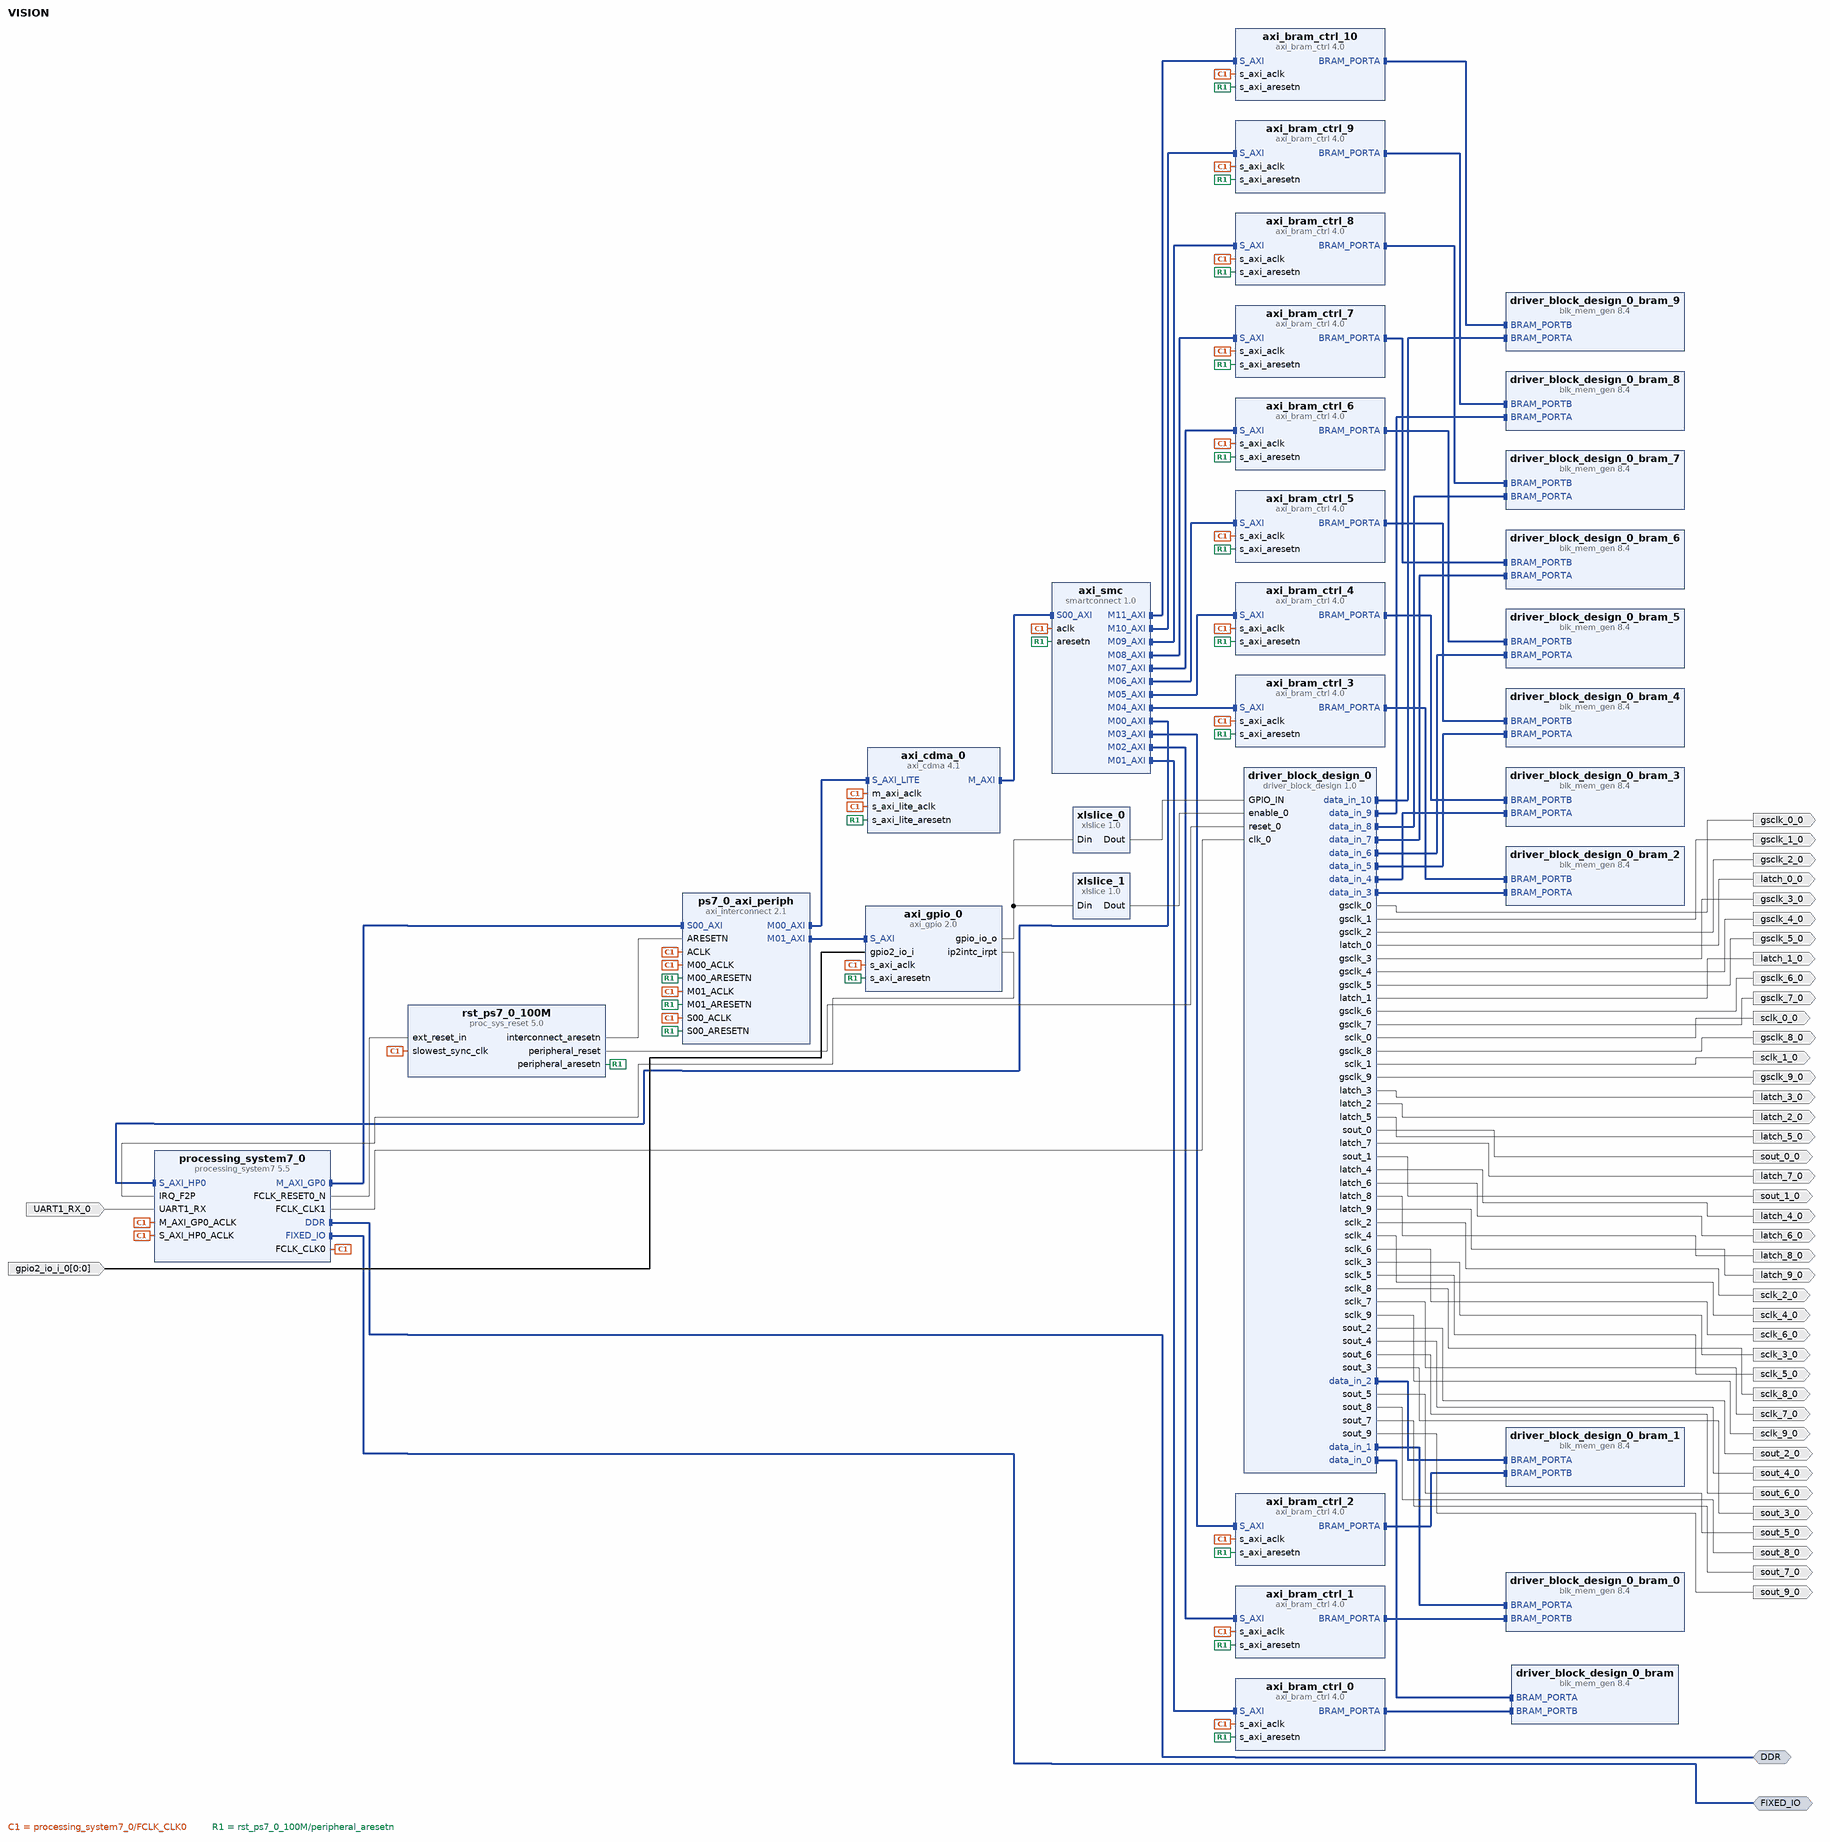
[diagram p0: block diagram of the top level]
# Vivado block design VISION, xc7z020clg400-1, Vivado 2018.2
create_bd_design VISION

create_bd_intf_port -mode Master -vlnv xilinx.com:interface:ddrx_rtl:1.0 DDR
create_bd_intf_port -mode Master -vlnv xilinx.com:display_processing_system7:fixedio_rtl:1.0 FIXED_IO
create_bd_port -dir O sclk_0_0
create_bd_port -dir O latch_0_0
create_bd_port -dir O gsclk_0_0
create_bd_port -dir O sout_0_0
create_bd_port -dir I -from 0 -to 0 gpio2_io_i_0
create_bd_port -dir I UART1_RX_0
create_bd_port -dir O sout_1_0
create_bd_port -dir O sclk_1_0
create_bd_port -dir O latch_1_0
create_bd_port -dir O gsclk_1_0
create_bd_port -dir O gsclk_3_0
create_bd_port -dir O gsclk_2_0
create_bd_port -dir O gsclk_4_0
create_bd_port -dir O gsclk_5_0
create_bd_port -dir O gsclk_6_0
create_bd_port -dir O gsclk_7_0
create_bd_port -dir O gsclk_8_0
create_bd_port -dir O gsclk_9_0
create_bd_port -dir O latch_7_0
create_bd_port -dir O latch_8_0
create_bd_port -dir O latch_5_0
create_bd_port -dir O latch_6_0
create_bd_port -dir O latch_3_0
create_bd_port -dir O latch_4_0
create_bd_port -dir O latch_2_0
create_bd_port -dir O latch_9_0
create_bd_port -dir O sclk_8_0
create_bd_port -dir O sclk_6_0
create_bd_port -dir O sclk_7_0
create_bd_port -dir O sclk_4_0
create_bd_port -dir O sclk_5_0
create_bd_port -dir O sclk_2_0
create_bd_port -dir O sclk_3_0
create_bd_port -dir O sclk_9_0
create_bd_port -dir O sout_8_0
create_bd_port -dir O sout_6_0
create_bd_port -dir O sout_7_0
create_bd_port -dir O sout_4_0
create_bd_port -dir O sout_5_0
create_bd_port -dir O sout_2_0
create_bd_port -dir O sout_3_0
create_bd_port -dir O sout_9_0

create_bd_cell -type ip -vlnv xilinx.com:ip:processing_system7:5.5 processing_system7_0
set_property -dict [list \
  CONFIG.PCW_FCLK_CLK1_BUF TRUE \
  CONFIG.PCW_UIPARAM_DDR_FREQ_MHZ 525 \
  CONFIG.PCW_CRYSTAL_PERIPHERAL_FREQMHZ 50 \
  CONFIG.PCW_APU_PERIPHERAL_FREQMHZ 650 \
  CONFIG.PCW_SDIO_PERIPHERAL_FREQMHZ 50 \
  CONFIG.PCW_UART_PERIPHERAL_FREQMHZ 100 \
  CONFIG.PCW_FPGA0_PERIPHERAL_FREQMHZ 100 \
  CONFIG.PCW_FPGA1_PERIPHERAL_FREQMHZ 50 \
  CONFIG.PCW_FPGA2_PERIPHERAL_FREQMHZ 200 \
  CONFIG.PCW_USE_S_AXI_HP0 1 \
  CONFIG.PCW_M_AXI_GP0_FREQMHZ 10 \
  CONFIG.PCW_S_AXI_HP0_FREQMHZ 10 \
  CONFIG.PCW_USE_FABRIC_INTERRUPT 1 \
  CONFIG.PCW_EN_CLK1_PORT 1 \
  CONFIG.PCW_IRQ_F2P_INTR 1 \
  CONFIG.PCW_PERIPHERAL_BOARD_PRESET part0 \
  CONFIG.PCW_PRESET_BANK1_VOLTAGE {LVCMOS 1.8V} \
  CONFIG.PCW_UIPARAM_DDR_BUS_WIDTH {16 Bit} \
  CONFIG.PCW_UIPARAM_DDR_PARTNO {MT41J256M16 RE-125} \
  CONFIG.PCW_QSPI_PERIPHERAL_ENABLE 1 \
  CONFIG.PCW_QSPI_QSPI_IO {MIO 1 .. 6} \
  CONFIG.PCW_QSPI_GRP_SINGLE_SS_ENABLE 1 \
  CONFIG.PCW_QSPI_GRP_SINGLE_SS_IO {MIO 1 .. 6} \
  CONFIG.PCW_SINGLE_QSPI_DATA_MODE x4 \
  CONFIG.PCW_QSPI_GRP_FBCLK_ENABLE 1 \
  CONFIG.PCW_QSPI_GRP_FBCLK_IO {MIO 8} \
  CONFIG.PCW_ENET0_PERIPHERAL_ENABLE 1 \
  CONFIG.PCW_ENET0_ENET0_IO {MIO 16 .. 27} \
  CONFIG.PCW_ENET0_GRP_MDIO_ENABLE 1 \
  CONFIG.PCW_ENET0_GRP_MDIO_IO {MIO 52 .. 53} \
  CONFIG.PCW_ENET_RESET_ENABLE 1 \
  CONFIG.PCW_ENET_RESET_SELECT {Share reset pin} \
  CONFIG.PCW_ENET0_RESET_ENABLE 1 \
  CONFIG.PCW_ENET0_RESET_IO {MIO 9} \
  CONFIG.PCW_SD0_PERIPHERAL_ENABLE 1 \
  CONFIG.PCW_SD0_SD0_IO {MIO 40 .. 45} \
  CONFIG.PCW_SD0_GRP_CD_ENABLE 1 \
  CONFIG.PCW_SD0_GRP_CD_IO {MIO 47} \
  CONFIG.PCW_SD0_GRP_WP_ENABLE 0 \
  CONFIG.PCW_UART0_PERIPHERAL_ENABLE 1 \
  CONFIG.PCW_UART0_UART0_IO {MIO 14 .. 15} \
  CONFIG.PCW_UART1_PERIPHERAL_ENABLE 1 \
  CONFIG.PCW_UART1_UART1_IO EMIO \
  CONFIG.PCW_USB0_PERIPHERAL_ENABLE 1 \
  CONFIG.PCW_USB0_USB0_IO {MIO 28 .. 39} \
  CONFIG.PCW_USB_RESET_ENABLE 1 \
  CONFIG.PCW_USB_RESET_SELECT {Share reset pin} \
  CONFIG.PCW_USB0_RESET_ENABLE 1 \
  CONFIG.PCW_USB0_RESET_IO {MIO 46} \
  CONFIG.PCW_I2C_RESET_ENABLE 0 \
  CONFIG.PCW_GPIO_MIO_GPIO_ENABLE 1 \
  CONFIG.PCW_GPIO_MIO_GPIO_IO MIO \
  CONFIG.PCW_FPGA_FCLK1_ENABLE 1 \
] [get_bd_cells processing_system7_0]
# 498 more settings of processing_system7_0 are not shown: defaults, MIO pin electricals, DDR timing, and values the tool derives
create_bd_cell -type ip -vlnv xilinx.com:ip:axi_cdma:4.1 axi_cdma_0
set_property -dict {CONFIG.C_INCLUDE_SG 0} [get_bd_cells axi_cdma_0]
create_bd_cell -type ip -vlnv xilinx.com:ip:smartconnect:1.0 axi_smc
set_property -dict {CONFIG.NUM_MI 12 CONFIG.NUM_SI 1} [get_bd_cells axi_smc]
create_bd_cell -type ip -vlnv xilinx.com:ip:proc_sys_reset:5.0 rst_ps7_0_100M
create_bd_cell -type ip -vlnv xilinx.com:ip:axi_interconnect:2.1 ps7_0_axi_periph
set_property -dict {CONFIG.NUM_MI 2} [get_bd_cells ps7_0_axi_periph]
create_bd_cell -type ip -vlnv xilinx.com:ip:axi_gpio:2.0 axi_gpio_0
set_property -dict [list \
  CONFIG.C_GPIO_WIDTH 4 \
  CONFIG.C_GPIO2_WIDTH 1 \
  CONFIG.C_IS_DUAL 1 \
  CONFIG.C_ALL_INPUTS_2 1 \
  CONFIG.C_INTERRUPT_PRESENT 1 \
  CONFIG.C_ALL_OUTPUTS 1 \
] [get_bd_cells axi_gpio_0]
create_bd_cell -type ip -vlnv xilinx.com:ip:blk_mem_gen:8.4 driver_block_design_0_bram
set_property -dict {CONFIG.Memory_Type True_Dual_Port_RAM} [get_bd_cells driver_block_design_0_bram]
create_bd_cell -type ip -vlnv xilinx.com:ip:blk_mem_gen:8.4 driver_block_design_0_bram_0
set_property -dict {CONFIG.Memory_Type True_Dual_Port_RAM} [get_bd_cells driver_block_design_0_bram_0]
create_bd_cell -type ip -vlnv xilinx.com:ip:axi_bram_ctrl:4.0 axi_bram_ctrl_0
set_property -dict {CONFIG.SINGLE_PORT_BRAM 1} [get_bd_cells axi_bram_ctrl_0]
create_bd_cell -type ip -vlnv xilinx.com:ip:axi_bram_ctrl:4.0 axi_bram_ctrl_1
set_property -dict {CONFIG.SINGLE_PORT_BRAM 1} [get_bd_cells axi_bram_ctrl_1]
create_bd_cell -type ip -vlnv xilinx.com:ip:xlslice:1.0 xlslice_0
set_property -dict {CONFIG.DIN_TO 0 CONFIG.DIN_FROM 2 CONFIG.DIN_WIDTH 4 CONFIG.DOUT_WIDTH 3} [get_bd_cells xlslice_0]
create_bd_cell -type ip -vlnv xilinx.com:ip:xlslice:1.0 xlslice_1
set_property -dict {CONFIG.DIN_TO 3 CONFIG.DIN_FROM 3 CONFIG.DIN_WIDTH 4 CONFIG.DOUT_WIDTH 1} [get_bd_cells xlslice_1]
create_bd_cell -type ip -vlnv xilinx.com:ip:blk_mem_gen:8.4 driver_block_design_0_bram_1
set_property -dict [list \
  CONFIG.Memory_Type True_Dual_Port_RAM \
  CONFIG.Enable_B Use_ENB_Pin \
  CONFIG.Use_RSTB_Pin true \
  CONFIG.Port_B_Clock 100 \
  CONFIG.Port_B_Write_Rate 50 \
  CONFIG.Port_B_Enable_Rate 100 \
] [get_bd_cells driver_block_design_0_bram_1]
create_bd_cell -type ip -vlnv xilinx.com:ip:axi_bram_ctrl:4.0 axi_bram_ctrl_2
set_property -dict {CONFIG.SINGLE_PORT_BRAM 1} [get_bd_cells axi_bram_ctrl_2]
create_bd_cell -type ip -vlnv xilinx.com:ip:axi_bram_ctrl:4.0 axi_bram_ctrl_3
set_property -dict {CONFIG.SINGLE_PORT_BRAM 1} [get_bd_cells axi_bram_ctrl_3]
create_bd_cell -type ip -vlnv xilinx.com:user:driver_block_design:1.0 driver_block_design_0
create_bd_cell -type ip -vlnv xilinx.com:ip:blk_mem_gen:8.4 driver_block_design_0_bram_2
set_property -dict [list \
  CONFIG.Memory_Type True_Dual_Port_RAM \
  CONFIG.Enable_B Use_ENB_Pin \
  CONFIG.Use_RSTB_Pin true \
  CONFIG.Port_B_Clock 100 \
  CONFIG.Port_B_Write_Rate 50 \
  CONFIG.Port_B_Enable_Rate 100 \
] [get_bd_cells driver_block_design_0_bram_2]
create_bd_cell -type ip -vlnv xilinx.com:ip:blk_mem_gen:8.4 driver_block_design_0_bram_3
set_property -dict [list \
  CONFIG.Memory_Type True_Dual_Port_RAM \
  CONFIG.Enable_B Use_ENB_Pin \
  CONFIG.Use_RSTB_Pin true \
  CONFIG.Port_B_Clock 100 \
  CONFIG.Port_B_Write_Rate 50 \
  CONFIG.Port_B_Enable_Rate 100 \
] [get_bd_cells driver_block_design_0_bram_3]
create_bd_cell -type ip -vlnv xilinx.com:ip:blk_mem_gen:8.4 driver_block_design_0_bram_4
set_property -dict [list \
  CONFIG.Memory_Type True_Dual_Port_RAM \
  CONFIG.Enable_B Use_ENB_Pin \
  CONFIG.Use_RSTB_Pin true \
  CONFIG.Port_B_Clock 100 \
  CONFIG.Port_B_Write_Rate 50 \
  CONFIG.Port_B_Enable_Rate 100 \
] [get_bd_cells driver_block_design_0_bram_4]
create_bd_cell -type ip -vlnv xilinx.com:ip:blk_mem_gen:8.4 driver_block_design_0_bram_5
set_property -dict [list \
  CONFIG.Memory_Type True_Dual_Port_RAM \
  CONFIG.Enable_B Use_ENB_Pin \
  CONFIG.Use_RSTB_Pin true \
  CONFIG.Port_B_Clock 100 \
  CONFIG.Port_B_Write_Rate 50 \
  CONFIG.Port_B_Enable_Rate 100 \
] [get_bd_cells driver_block_design_0_bram_5]
create_bd_cell -type ip -vlnv xilinx.com:ip:blk_mem_gen:8.4 driver_block_design_0_bram_6
set_property -dict [list \
  CONFIG.Memory_Type True_Dual_Port_RAM \
  CONFIG.Enable_B Use_ENB_Pin \
  CONFIG.Use_RSTB_Pin true \
  CONFIG.Port_B_Clock 100 \
  CONFIG.Port_B_Write_Rate 50 \
  CONFIG.Port_B_Enable_Rate 100 \
] [get_bd_cells driver_block_design_0_bram_6]
create_bd_cell -type ip -vlnv xilinx.com:ip:blk_mem_gen:8.4 driver_block_design_0_bram_7
set_property -dict [list \
  CONFIG.Memory_Type True_Dual_Port_RAM \
  CONFIG.Enable_B Use_ENB_Pin \
  CONFIG.Use_RSTB_Pin true \
  CONFIG.Port_B_Clock 100 \
  CONFIG.Port_B_Write_Rate 50 \
  CONFIG.Port_B_Enable_Rate 100 \
] [get_bd_cells driver_block_design_0_bram_7]
create_bd_cell -type ip -vlnv xilinx.com:ip:blk_mem_gen:8.4 driver_block_design_0_bram_8
set_property -dict [list \
  CONFIG.Memory_Type True_Dual_Port_RAM \
  CONFIG.Enable_B Use_ENB_Pin \
  CONFIG.Use_RSTB_Pin true \
  CONFIG.Port_B_Clock 100 \
  CONFIG.Port_B_Write_Rate 50 \
  CONFIG.Port_B_Enable_Rate 100 \
] [get_bd_cells driver_block_design_0_bram_8]
create_bd_cell -type ip -vlnv xilinx.com:ip:blk_mem_gen:8.4 driver_block_design_0_bram_9
set_property -dict [list \
  CONFIG.Memory_Type True_Dual_Port_RAM \
  CONFIG.Enable_B Use_ENB_Pin \
  CONFIG.Use_RSTB_Pin true \
  CONFIG.Port_B_Clock 100 \
  CONFIG.Port_B_Write_Rate 50 \
  CONFIG.Port_B_Enable_Rate 100 \
] [get_bd_cells driver_block_design_0_bram_9]
create_bd_cell -type ip -vlnv xilinx.com:ip:axi_bram_ctrl:4.0 axi_bram_ctrl_4
set_property -dict {CONFIG.SINGLE_PORT_BRAM 1} [get_bd_cells axi_bram_ctrl_4]
create_bd_cell -type ip -vlnv xilinx.com:ip:axi_bram_ctrl:4.0 axi_bram_ctrl_5
set_property -dict {CONFIG.SINGLE_PORT_BRAM 1} [get_bd_cells axi_bram_ctrl_5]
create_bd_cell -type ip -vlnv xilinx.com:ip:axi_bram_ctrl:4.0 axi_bram_ctrl_6
set_property -dict {CONFIG.SINGLE_PORT_BRAM 1} [get_bd_cells axi_bram_ctrl_6]
create_bd_cell -type ip -vlnv xilinx.com:ip:axi_bram_ctrl:4.0 axi_bram_ctrl_7
set_property -dict {CONFIG.SINGLE_PORT_BRAM 1} [get_bd_cells axi_bram_ctrl_7]
create_bd_cell -type ip -vlnv xilinx.com:ip:axi_bram_ctrl:4.0 axi_bram_ctrl_8
set_property -dict {CONFIG.SINGLE_PORT_BRAM 1} [get_bd_cells axi_bram_ctrl_8]
create_bd_cell -type ip -vlnv xilinx.com:ip:axi_bram_ctrl:4.0 axi_bram_ctrl_9
set_property -dict {CONFIG.SINGLE_PORT_BRAM 1} [get_bd_cells axi_bram_ctrl_9]
create_bd_cell -type ip -vlnv xilinx.com:ip:axi_bram_ctrl:4.0 axi_bram_ctrl_10
set_property -dict {CONFIG.SINGLE_PORT_BRAM 1} [get_bd_cells axi_bram_ctrl_10]

# ---- connections ----

connect_bd_intf_net [get_bd_intf_pins axi_cdma_0/M_AXI] [get_bd_intf_pins axi_smc/S00_AXI]
connect_bd_intf_net [get_bd_intf_pins axi_smc/M00_AXI] [get_bd_intf_pins processing_system7_0/S_AXI_HP0]
connect_bd_intf_net [get_bd_intf_pins processing_system7_0/M_AXI_GP0] [get_bd_intf_pins ps7_0_axi_periph/S00_AXI]
connect_bd_intf_net [get_bd_intf_pins ps7_0_axi_periph/M00_AXI] [get_bd_intf_pins axi_cdma_0/S_AXI_LITE]
connect_bd_intf_net [get_bd_intf_pins driver_block_design_0_bram/BRAM_PORTA] [get_bd_intf_pins driver_block_design_0/data_in_0]
connect_bd_intf_net [get_bd_intf_pins driver_block_design_0_bram_0/BRAM_PORTA] [get_bd_intf_pins driver_block_design_0/data_in_1]
connect_bd_intf_net [get_bd_intf_pins ps7_0_axi_periph/M01_AXI] [get_bd_intf_pins axi_gpio_0/S_AXI]
connect_bd_intf_net [get_bd_intf_pins axi_smc/M01_AXI] [get_bd_intf_pins axi_bram_ctrl_0/S_AXI]
connect_bd_intf_net [get_bd_intf_pins driver_block_design_0_bram/BRAM_PORTB] [get_bd_intf_pins axi_bram_ctrl_0/BRAM_PORTA]
connect_bd_intf_net [get_bd_intf_pins axi_smc/M02_AXI] [get_bd_intf_pins axi_bram_ctrl_1/S_AXI]
connect_bd_intf_net [get_bd_intf_pins driver_block_design_0_bram_0/BRAM_PORTB] [get_bd_intf_pins axi_bram_ctrl_1/BRAM_PORTA]
connect_bd_intf_net [get_bd_intf_pins driver_block_design_0_bram_1/BRAM_PORTA] [get_bd_intf_pins driver_block_design_0/data_in_2]
connect_bd_intf_net [get_bd_intf_pins driver_block_design_0_bram_1/BRAM_PORTB] [get_bd_intf_pins axi_bram_ctrl_2/BRAM_PORTA]
connect_bd_intf_net [get_bd_intf_pins axi_smc/M03_AXI] [get_bd_intf_pins axi_bram_ctrl_2/S_AXI]
connect_bd_intf_net [get_bd_intf_pins axi_smc/M04_AXI] [get_bd_intf_pins axi_bram_ctrl_3/S_AXI]
connect_bd_intf_net [get_bd_intf_pins driver_block_design_0_bram_2/BRAM_PORTA] [get_bd_intf_pins driver_block_design_0/data_in_3]
connect_bd_intf_net [get_bd_intf_pins driver_block_design_0/data_in_4] [get_bd_intf_pins driver_block_design_0_bram_3/BRAM_PORTA]
connect_bd_intf_net [get_bd_intf_pins driver_block_design_0_bram_4/BRAM_PORTA] [get_bd_intf_pins driver_block_design_0/data_in_5]
connect_bd_intf_net [get_bd_intf_pins driver_block_design_0/data_in_6] [get_bd_intf_pins driver_block_design_0_bram_5/BRAM_PORTA]
connect_bd_intf_net [get_bd_intf_pins driver_block_design_0_bram_6/BRAM_PORTA] [get_bd_intf_pins driver_block_design_0/data_in_7]
connect_bd_intf_net [get_bd_intf_pins driver_block_design_0/data_in_8] [get_bd_intf_pins driver_block_design_0_bram_7/BRAM_PORTA]
connect_bd_intf_net [get_bd_intf_pins driver_block_design_0_bram_8/BRAM_PORTA] [get_bd_intf_pins driver_block_design_0/data_in_9]
connect_bd_intf_net [get_bd_intf_pins driver_block_design_0/data_in_10] [get_bd_intf_pins driver_block_design_0_bram_9/BRAM_PORTA]
connect_bd_intf_net [get_bd_intf_pins axi_smc/M05_AXI] [get_bd_intf_pins axi_bram_ctrl_4/S_AXI]
connect_bd_intf_net [get_bd_intf_pins axi_smc/M06_AXI] [get_bd_intf_pins axi_bram_ctrl_5/S_AXI]
connect_bd_intf_net [get_bd_intf_pins axi_smc/M07_AXI] [get_bd_intf_pins axi_bram_ctrl_6/S_AXI]
connect_bd_intf_net [get_bd_intf_pins axi_smc/M08_AXI] [get_bd_intf_pins axi_bram_ctrl_7/S_AXI]
connect_bd_intf_net [get_bd_intf_pins axi_smc/M09_AXI] [get_bd_intf_pins axi_bram_ctrl_8/S_AXI]
connect_bd_intf_net [get_bd_intf_pins axi_smc/M10_AXI] [get_bd_intf_pins axi_bram_ctrl_9/S_AXI]
connect_bd_intf_net [get_bd_intf_pins axi_smc/M11_AXI] [get_bd_intf_pins axi_bram_ctrl_10/S_AXI]
connect_bd_intf_net [get_bd_intf_pins driver_block_design_0_bram_2/BRAM_PORTB] [get_bd_intf_pins axi_bram_ctrl_3/BRAM_PORTA]
connect_bd_intf_net [get_bd_intf_pins driver_block_design_0_bram_3/BRAM_PORTB] [get_bd_intf_pins axi_bram_ctrl_4/BRAM_PORTA]
connect_bd_intf_net [get_bd_intf_pins driver_block_design_0_bram_4/BRAM_PORTB] [get_bd_intf_pins axi_bram_ctrl_5/BRAM_PORTA]
connect_bd_intf_net [get_bd_intf_pins driver_block_design_0_bram_5/BRAM_PORTB] [get_bd_intf_pins axi_bram_ctrl_6/BRAM_PORTA]
connect_bd_intf_net [get_bd_intf_pins driver_block_design_0_bram_6/BRAM_PORTB] [get_bd_intf_pins axi_bram_ctrl_7/BRAM_PORTA]
connect_bd_intf_net [get_bd_intf_pins driver_block_design_0_bram_7/BRAM_PORTB] [get_bd_intf_pins axi_bram_ctrl_8/BRAM_PORTA]
connect_bd_intf_net [get_bd_intf_pins driver_block_design_0_bram_8/BRAM_PORTB] [get_bd_intf_pins axi_bram_ctrl_9/BRAM_PORTA]
connect_bd_intf_net [get_bd_intf_pins driver_block_design_0_bram_9/BRAM_PORTB] [get_bd_intf_pins axi_bram_ctrl_10/BRAM_PORTA]
connect_bd_intf_net [get_bd_intf_ports DDR] [get_bd_intf_pins processing_system7_0/DDR]
connect_bd_intf_net [get_bd_intf_ports FIXED_IO] [get_bd_intf_pins processing_system7_0/FIXED_IO]
connect_bd_net [get_bd_pins processing_system7_0/FCLK_CLK0] \
  [get_bd_pins axi_cdma_0/m_axi_aclk] [get_bd_pins axi_smc/aclk] [get_bd_pins processing_system7_0/S_AXI_HP0_ACLK] \
  [get_bd_pins rst_ps7_0_100M/slowest_sync_clk] [get_bd_pins processing_system7_0/M_AXI_GP0_ACLK] \
  [get_bd_pins axi_cdma_0/s_axi_lite_aclk] [get_bd_pins axi_gpio_0/s_axi_aclk] [get_bd_pins axi_bram_ctrl_0/s_axi_aclk] \
  [get_bd_pins axi_bram_ctrl_1/s_axi_aclk] [get_bd_pins axi_bram_ctrl_2/s_axi_aclk] [get_bd_pins axi_bram_ctrl_3/s_axi_aclk] \
  [get_bd_pins axi_bram_ctrl_4/s_axi_aclk] [get_bd_pins axi_bram_ctrl_5/s_axi_aclk] [get_bd_pins axi_bram_ctrl_6/s_axi_aclk] \
  [get_bd_pins axi_bram_ctrl_7/s_axi_aclk] [get_bd_pins axi_bram_ctrl_8/s_axi_aclk] [get_bd_pins axi_bram_ctrl_9/s_axi_aclk] \
  [get_bd_pins axi_bram_ctrl_10/s_axi_aclk] [get_bd_pins ps7_0_axi_periph/S00_ACLK] [get_bd_pins ps7_0_axi_periph/M00_ACLK] \
  [get_bd_pins ps7_0_axi_periph/ACLK] [get_bd_pins ps7_0_axi_periph/M01_ACLK]
connect_bd_net [get_bd_pins processing_system7_0/FCLK_RESET0_N] [get_bd_pins rst_ps7_0_100M/ext_reset_in]
connect_bd_net [get_bd_pins rst_ps7_0_100M/peripheral_aresetn] \
  [get_bd_pins axi_smc/aresetn] [get_bd_pins axi_cdma_0/s_axi_lite_aresetn] [get_bd_pins axi_gpio_0/s_axi_aresetn] \
  [get_bd_pins axi_bram_ctrl_0/s_axi_aresetn] [get_bd_pins axi_bram_ctrl_1/s_axi_aresetn] \
  [get_bd_pins axi_bram_ctrl_2/s_axi_aresetn] [get_bd_pins axi_bram_ctrl_3/s_axi_aresetn] \
  [get_bd_pins axi_bram_ctrl_4/s_axi_aresetn] [get_bd_pins axi_bram_ctrl_5/s_axi_aresetn] \
  [get_bd_pins axi_bram_ctrl_6/s_axi_aresetn] [get_bd_pins axi_bram_ctrl_7/s_axi_aresetn] \
  [get_bd_pins axi_bram_ctrl_8/s_axi_aresetn] [get_bd_pins axi_bram_ctrl_9/s_axi_aresetn] \
  [get_bd_pins axi_bram_ctrl_10/s_axi_aresetn] [get_bd_pins ps7_0_axi_periph/S00_ARESETN] \
  [get_bd_pins ps7_0_axi_periph/M00_ARESETN] [get_bd_pins ps7_0_axi_periph/M01_ARESETN]
connect_bd_net [get_bd_pins rst_ps7_0_100M/interconnect_aresetn] [get_bd_pins ps7_0_axi_periph/ARESETN]
connect_bd_net [get_bd_pins driver_block_design_0/sclk_0] [get_bd_ports sclk_0_0]
connect_bd_net [get_bd_pins driver_block_design_0/latch_0] [get_bd_ports latch_0_0]
connect_bd_net [get_bd_pins driver_block_design_0/gsclk_0] [get_bd_ports gsclk_0_0]
connect_bd_net [get_bd_pins driver_block_design_0/sout_0] [get_bd_ports sout_0_0]
connect_bd_net [get_bd_pins rst_ps7_0_100M/peripheral_reset] [get_bd_pins driver_block_design_0/reset_0]
connect_bd_net [get_bd_pins processing_system7_0/FCLK_CLK1] [get_bd_pins driver_block_design_0/clk_0]
connect_bd_net [get_bd_pins xlslice_1/Dout] [get_bd_pins driver_block_design_0/enable_0]
connect_bd_net [get_bd_pins xlslice_0/Dout] [get_bd_pins driver_block_design_0/GPIO_IN]
connect_bd_net [get_bd_pins axi_gpio_0/gpio_io_o] [get_bd_pins xlslice_0/Din] [get_bd_pins xlslice_1/Din]
connect_bd_net -net gpio2_io_i_0_1 [get_bd_ports gpio2_io_i_0] [get_bd_pins axi_gpio_0/gpio2_io_i]
connect_bd_net [get_bd_pins axi_gpio_0/ip2intc_irpt] [get_bd_pins processing_system7_0/IRQ_F2P]
connect_bd_net -net UART1_RX_0_1 [get_bd_ports UART1_RX_0] [get_bd_pins processing_system7_0/UART1_RX]
connect_bd_net [get_bd_pins driver_block_design_0/sout_1] [get_bd_ports sout_1_0]
connect_bd_net [get_bd_pins driver_block_design_0/sclk_1] [get_bd_ports sclk_1_0]
connect_bd_net [get_bd_pins driver_block_design_0/latch_1] [get_bd_ports latch_1_0]
connect_bd_net [get_bd_pins driver_block_design_0/gsclk_1] [get_bd_ports gsclk_1_0]
connect_bd_net [get_bd_pins driver_block_design_0/gsclk_3] [get_bd_ports gsclk_3_0]
connect_bd_net [get_bd_pins driver_block_design_0/gsclk_2] [get_bd_ports gsclk_2_0]
connect_bd_net [get_bd_pins driver_block_design_0/gsclk_4] [get_bd_ports gsclk_4_0]
connect_bd_net [get_bd_pins driver_block_design_0/gsclk_5] [get_bd_ports gsclk_5_0]
connect_bd_net [get_bd_pins driver_block_design_0/gsclk_6] [get_bd_ports gsclk_6_0]
connect_bd_net [get_bd_pins driver_block_design_0/gsclk_7] [get_bd_ports gsclk_7_0]
connect_bd_net [get_bd_pins driver_block_design_0/gsclk_8] [get_bd_ports gsclk_8_0]
connect_bd_net [get_bd_pins driver_block_design_0/gsclk_9] [get_bd_ports gsclk_9_0]
connect_bd_net [get_bd_pins driver_block_design_0/latch_7] [get_bd_ports latch_7_0]
connect_bd_net [get_bd_pins driver_block_design_0/latch_8] [get_bd_ports latch_8_0]
connect_bd_net [get_bd_pins driver_block_design_0/latch_5] [get_bd_ports latch_5_0]
connect_bd_net [get_bd_pins driver_block_design_0/latch_6] [get_bd_ports latch_6_0]
connect_bd_net [get_bd_pins driver_block_design_0/latch_3] [get_bd_ports latch_3_0]
connect_bd_net [get_bd_pins driver_block_design_0/latch_4] [get_bd_ports latch_4_0]
connect_bd_net [get_bd_pins driver_block_design_0/latch_2] [get_bd_ports latch_2_0]
connect_bd_net [get_bd_pins driver_block_design_0/latch_9] [get_bd_ports latch_9_0]
connect_bd_net [get_bd_pins driver_block_design_0/sclk_8] [get_bd_ports sclk_8_0]
connect_bd_net [get_bd_pins driver_block_design_0/sclk_6] [get_bd_ports sclk_6_0]
connect_bd_net [get_bd_pins driver_block_design_0/sclk_7] [get_bd_ports sclk_7_0]
connect_bd_net [get_bd_pins driver_block_design_0/sclk_4] [get_bd_ports sclk_4_0]
connect_bd_net [get_bd_pins driver_block_design_0/sclk_5] [get_bd_ports sclk_5_0]
connect_bd_net [get_bd_pins driver_block_design_0/sclk_2] [get_bd_ports sclk_2_0]
connect_bd_net [get_bd_pins driver_block_design_0/sclk_3] [get_bd_ports sclk_3_0]
connect_bd_net [get_bd_pins driver_block_design_0/sclk_9] [get_bd_ports sclk_9_0]
connect_bd_net [get_bd_pins driver_block_design_0/sout_8] [get_bd_ports sout_8_0]
connect_bd_net [get_bd_pins driver_block_design_0/sout_6] [get_bd_ports sout_6_0]
connect_bd_net [get_bd_pins driver_block_design_0/sout_7] [get_bd_ports sout_7_0]
connect_bd_net [get_bd_pins driver_block_design_0/sout_4] [get_bd_ports sout_4_0]
connect_bd_net [get_bd_pins driver_block_design_0/sout_5] [get_bd_ports sout_5_0]
connect_bd_net [get_bd_pins driver_block_design_0/sout_2] [get_bd_ports sout_2_0]
connect_bd_net [get_bd_pins driver_block_design_0/sout_3] [get_bd_ports sout_3_0]
connect_bd_net [get_bd_pins driver_block_design_0/sout_9] [get_bd_ports sout_9_0]

# ---- address map ----
assign_bd_address -offset 0x00000000 -range 512M -target_address_space [get_bd_addr_spaces axi_cdma_0/Data] [get_bd_addr_segs processing_system7_0/S_AXI_HP0/HP0_DDR_LOWOCM]
assign_bd_address -offset 0xC0000000 -range 8K -target_address_space [get_bd_addr_spaces axi_cdma_0/Data] [get_bd_addr_segs axi_bram_ctrl_0/S_AXI/Mem0]
assign_bd_address -offset 0xC2000000 -range 8K -target_address_space [get_bd_addr_spaces axi_cdma_0/Data] [get_bd_addr_segs axi_bram_ctrl_1/S_AXI/Mem0]
assign_bd_address -offset 0xC4000000 -range 8K -target_address_space [get_bd_addr_spaces axi_cdma_0/Data] [get_bd_addr_segs axi_bram_ctrl_2/S_AXI/Mem0]
assign_bd_address -offset 0xC6000000 -range 8K -target_address_space [get_bd_addr_spaces axi_cdma_0/Data] [get_bd_addr_segs axi_bram_ctrl_3/S_AXI/Mem0]
assign_bd_address -offset 0xC8000000 -range 8K -target_address_space [get_bd_addr_spaces axi_cdma_0/Data] [get_bd_addr_segs axi_bram_ctrl_4/S_AXI/Mem0]
assign_bd_address -offset 0xCA000000 -range 8K -target_address_space [get_bd_addr_spaces axi_cdma_0/Data] [get_bd_addr_segs axi_bram_ctrl_5/S_AXI/Mem0]
assign_bd_address -offset 0xCC000000 -range 8K -target_address_space [get_bd_addr_spaces axi_cdma_0/Data] [get_bd_addr_segs axi_bram_ctrl_6/S_AXI/Mem0]
assign_bd_address -offset 0xCE000000 -range 8K -target_address_space [get_bd_addr_spaces axi_cdma_0/Data] [get_bd_addr_segs axi_bram_ctrl_7/S_AXI/Mem0]
assign_bd_address -offset 0xD0000000 -range 8K -target_address_space [get_bd_addr_spaces axi_cdma_0/Data] [get_bd_addr_segs axi_bram_ctrl_8/S_AXI/Mem0]
assign_bd_address -offset 0xD2000000 -range 8K -target_address_space [get_bd_addr_spaces axi_cdma_0/Data] [get_bd_addr_segs axi_bram_ctrl_9/S_AXI/Mem0]
assign_bd_address -offset 0xD4000000 -range 8K -target_address_space [get_bd_addr_spaces axi_cdma_0/Data] [get_bd_addr_segs axi_bram_ctrl_10/S_AXI/Mem0]
assign_bd_address -offset 0x41200000 -range 64K -target_address_space [get_bd_addr_spaces processing_system7_0/Data] [get_bd_addr_segs axi_gpio_0/S_AXI/Reg]
assign_bd_address -offset 0x7E200000 -range 64K -target_address_space [get_bd_addr_spaces processing_system7_0/Data] [get_bd_addr_segs axi_cdma_0/S_AXI_LITE/Reg]

validate_bd_design
save_bd_design
